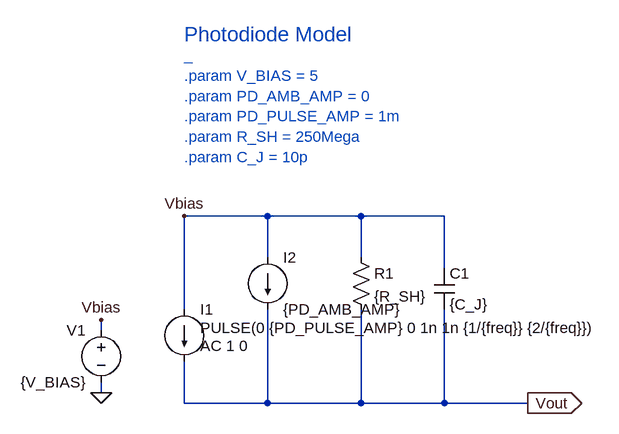
[diagram p0: schematic pd_r001.asc]
pd_r001.asc, the LTspice schematic file:
Version 4
SHEET 1 948 680
WIRE 192 64 64 64
WIRE 336 64 192 64
WIRE 464 64 336 64
WIRE 192 128 192 64
WIRE 336 128 336 64
WIRE 464 144 464 64
WIRE 64 208 64 64
WIRE -64 240 -64 224
WIRE -64 336 -64 320
WIRE 64 352 64 288
WIRE 192 352 192 208
WIRE 192 352 64 352
WIRE 336 352 336 208
WIRE 336 352 192 352
WIRE 464 352 464 208
WIRE 464 352 336 352
WIRE 592 352 464 352
FLAG 592 352 Vout
IOPIN 592 352 Out
FLAG -64 336 0
FLAG -64 224 Vbias
FLAG 64 64 Vbias
SYMBOL current 64 208 R0
WINDOW 3 24 28 Left 2
WINDOW 123 24 56 Left 2
WINDOW 39 0 0 Left 2
SYMATTR Value PULSE(0 {PD_PULSE_AMP} 0 1n 1n {1/{freq}} {2/{freq}})
SYMATTR Value2 AC 1 0
SYMATTR InstName I1
SYMBOL current 192 128 R0
WINDOW 123 0 0 Left 2
WINDOW 39 0 0 Left 2
SYMATTR InstName I2
SYMATTR Value {PD_AMB_AMP}
SYMBOL cap 448 144 R0
SYMATTR InstName C1
SYMATTR Value {C_J}
SYMBOL res 320 112 R0
SYMATTR InstName R1
SYMATTR Value {R_SH}
SYMBOL voltage -64 224 M0
WINDOW 123 0 0 Left 2
WINDOW 39 0 0 Left 2
SYMATTR InstName V1
SYMATTR Value {V_BIAS}
TEXT 64 -216 Left 3 ;Photodiode Model
TEXT 64 -152 Left 2 ;.param V_BIAS = 5\n.param PD_AMB_AMP = 0\n.param PD_PULSE_AMP = 1m\n.param R_SH = 250Mega\n.param C_J = 10p
TEXT 64 -184 Left 2 ;_

The netlist it stands for:
* pd_r001.asc
I1 Vbias Vout PULSE(0 {PD_PULSE_AMP} 0 1n 1n {1/{freq}} {2/{freq}}) AC 1 0
I2 Vbias Vout {PD_AMB_AMP}
C1 Vbias Vout {C_J}
R1 Vbias Vout {R_SH}
V1 Vbias 0 {V_BIAS}
* Photodiode Model
* .param V_BIAS = 5
* .param PD_AMB_AMP = 0
* .param PD_PULSE_AMP = 1m
* .param R_SH = 250Mega
* .param C_J = 10p
* _
.backanno
.end